# Altium schematic sheet pi-i2c.SchDoc
size A4
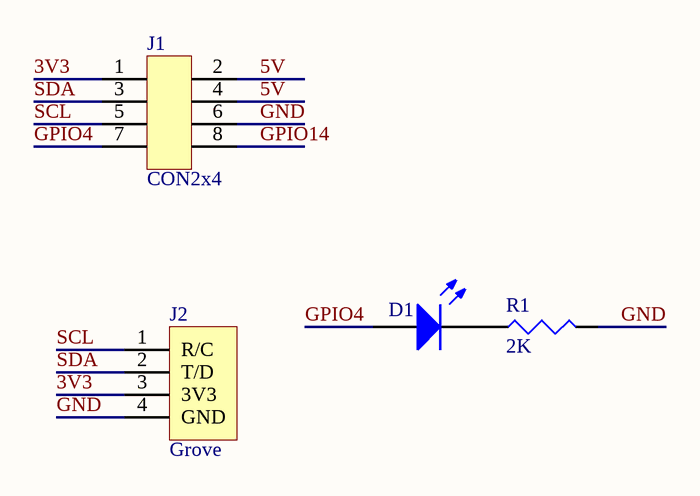
[diagram p0: pi-i2c.SchDoc]

## Parts
D1  (no value)
J1  CON2x4  [2x4P_SMT_2.54mm]
J2  Grove  [S4B-PH-SM4]
R1  2K  [0603_R]

## Nets
3V3: J1.1 J2.3(3V3)
5V: J1.2 J1.4
GND: J1.6 J2.4(GND) R1.2
GPIO4: D1.1(A) J1.7
GPIO14: J1.8
SCL: J1.5 J2.1(R/C)
SDA: J1.3 J2.2(T/D)
NetD1_2: D1.2(K) R1.1

## Library data of the parts
D1 = LED: Published: 8-Jun-2000; LatestRevisionDate: 08-Jul-2005; LatestRevisionNote: Mech Layer 1 removed.; PackageReference: LED-1; Publisher: Altium Limited; PackageDescription: LED; 2 Leads
R1 = Res: Published: 8-Jun-2000; LatestRevisionDate: 29-May-2009; LatestRevisionNote: IPC-7351 Footprint Added.; PackageReference: J1-0603; Publisher: Altium Limited; PackageDescription: Chip Resistor